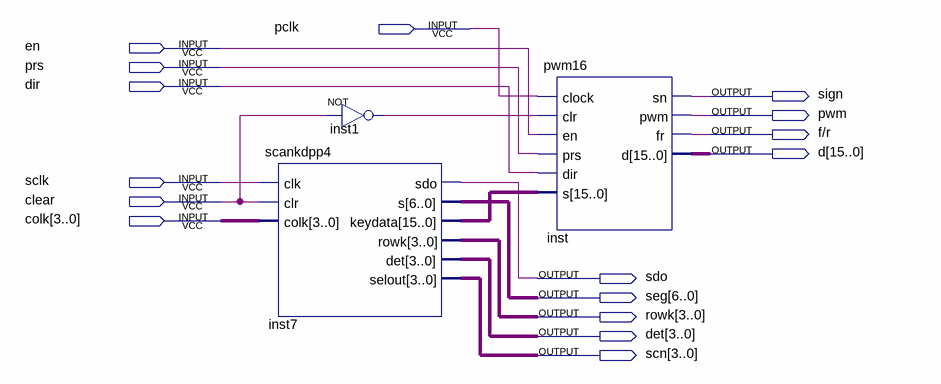
[diagram p0: schematic sheet]
// Quartus schematic pwmp16.bdf as structural Verilog: 3 symbols, 16 pins
module pwmp16 (
  input  pclk,
  input  en,
  input  prs,
  input  dir,
  input  sclk,
  input  clear,
  input  [3:0] colk,
  output sign,
  output pwm,
  output \f/r ,
  output [15:0] d,
  output sdo,
  output [6:0] seg,
  output [3:0] rowk,
  output [3:0] det,
  output [3:0] scn
);

  wire inst1_out;
  wire [15:0] inst7_keydata;

  scankdpp4 inst7 (
    .clk(sclk), .clr(clear), .colk(colk), .sdo(sdo), .s(seg), .keydata(inst7_keydata), .rowk(rowk),
    .det(det), .selout(scn));
  not inst1 (inst1_out, clear);
  pwm16 inst (
    .clock(pclk), .clr(inst1_out), .en(en), .prs(prs), .dir(dir), .s(inst7_keydata), .sn(sign), .pwm(pwm),
    .fr(\f/r ), .d(d));
endmodule
